# EAGLE design patchlink (EAGLE 6.6.0)
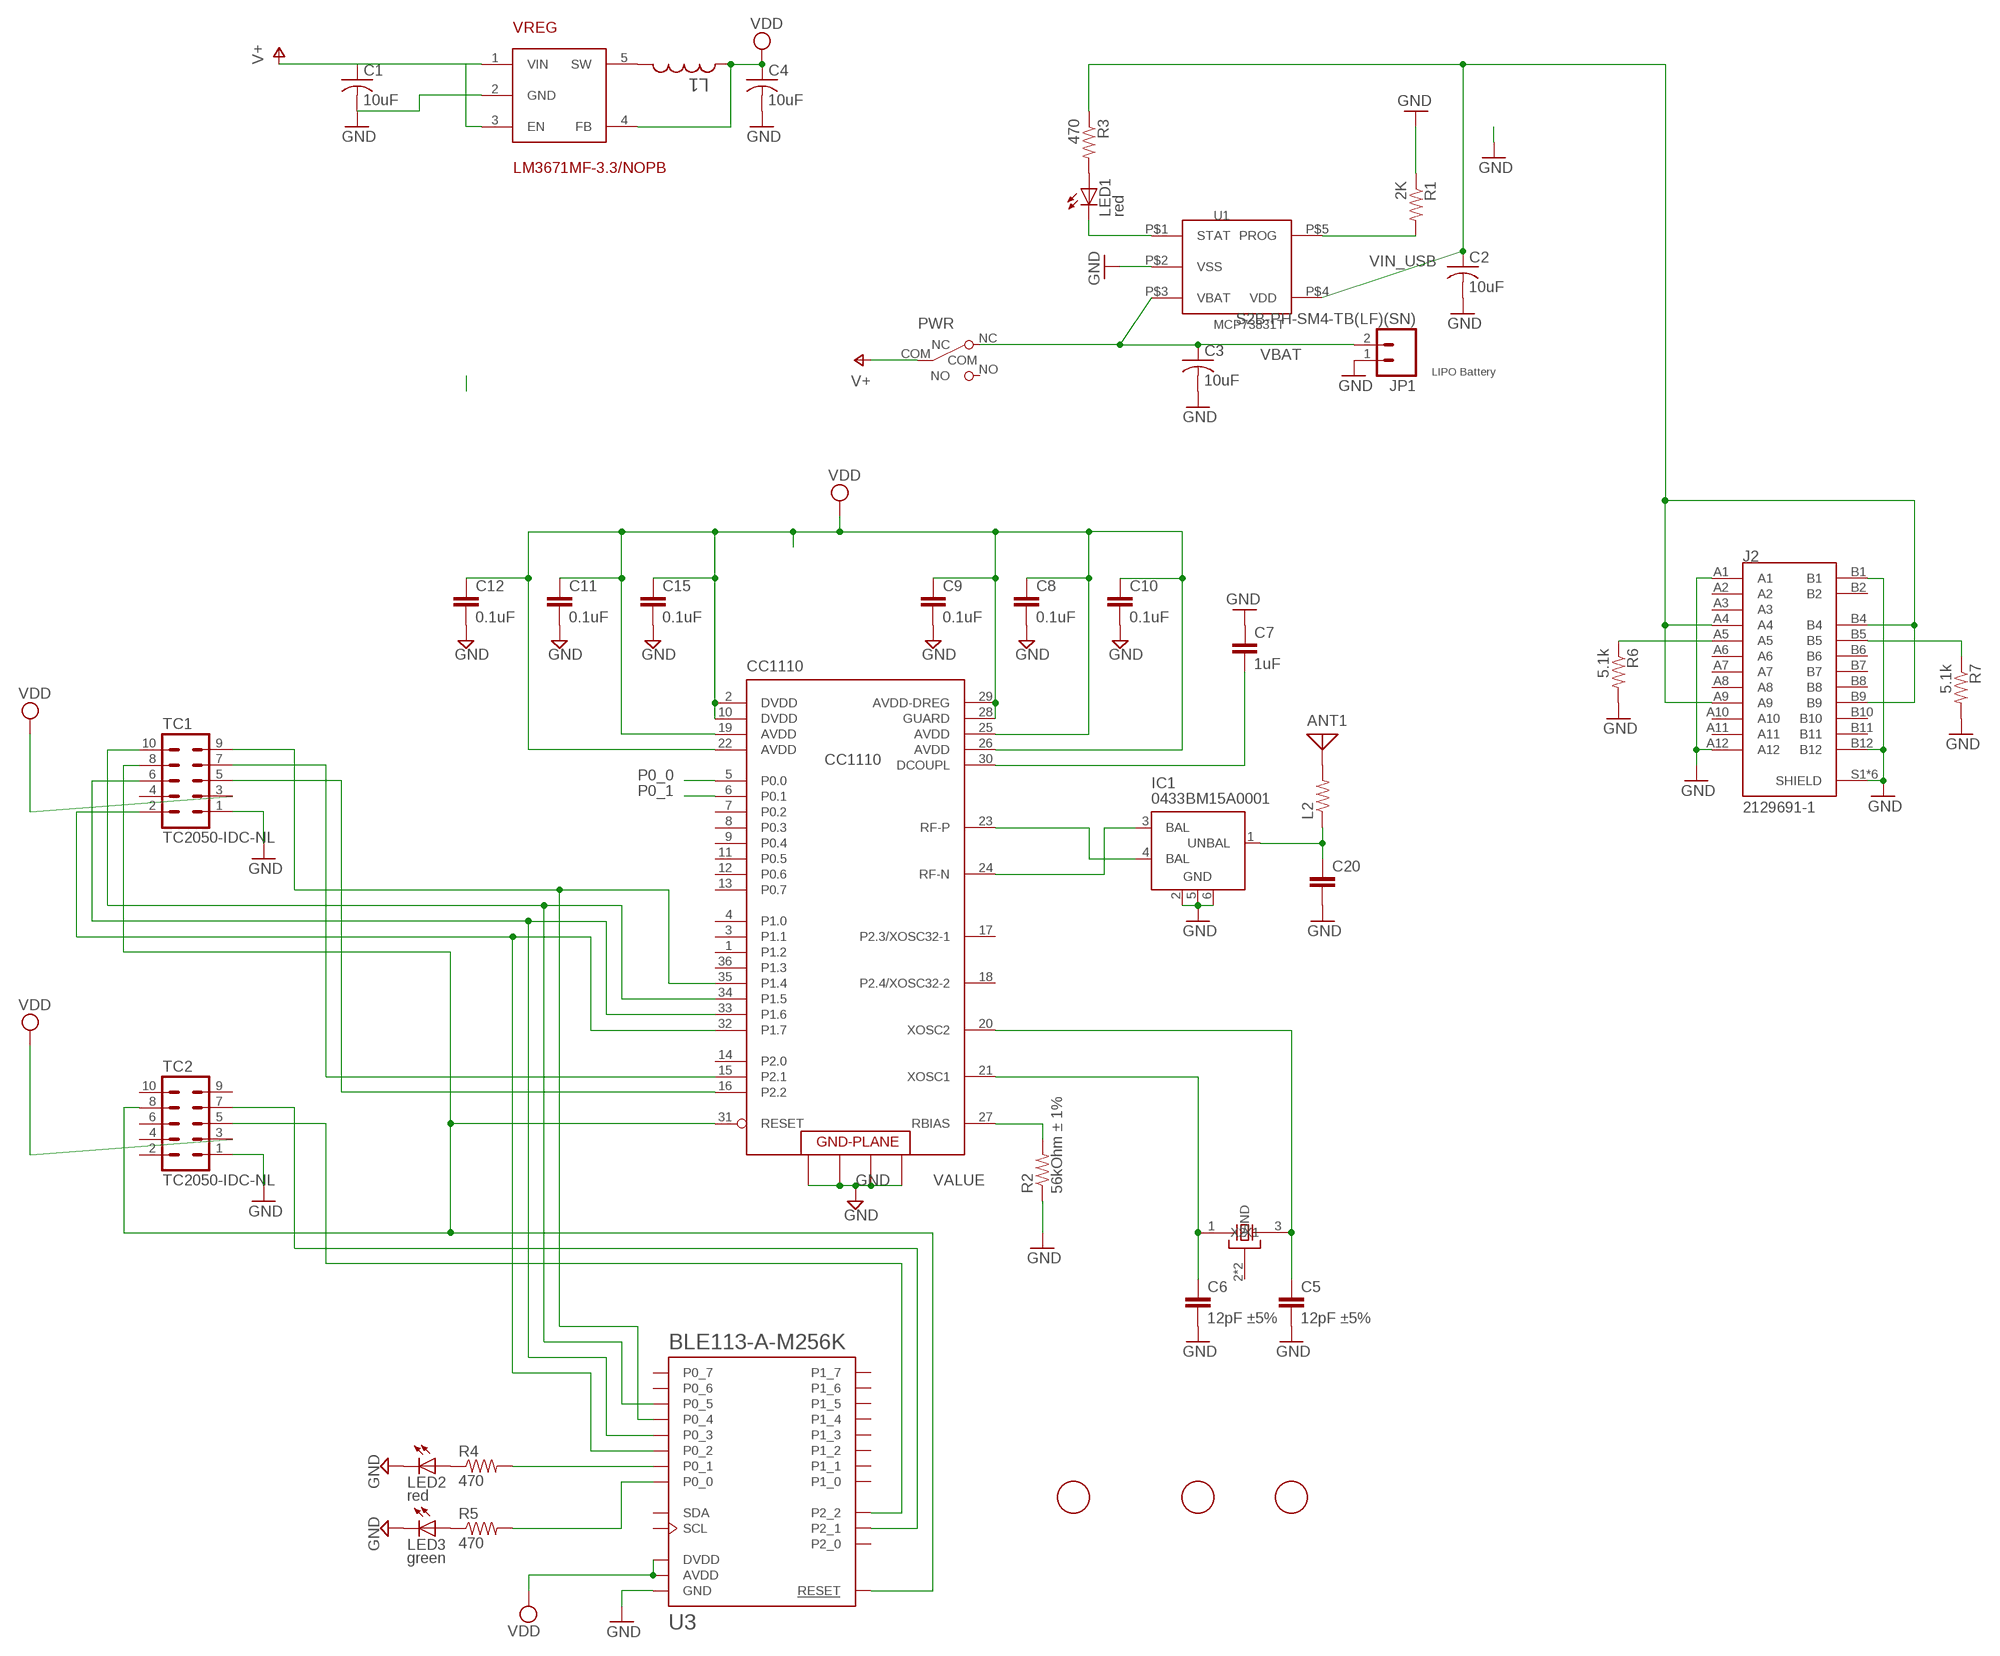
[diagram p0: schematic, sheet 1]

## Parts
ANT1  ANTENNASMT  [0433AT62A0020]
C1  10uF  C-USC1206  [C1206]
C2  10uF  C-USC1206  [C1206]
C3  10uF  C-USC1206  [C1206]
C4  10uF  C-USC1206  [C1206]
C5  12pF ±5%  C-EUC0402K  [C0402K]
C6  12pF ±5%  C-EUC0402K  [C0402K]
C7  1uF  C-EUC0402  [C0402]
C8  0.1uF  C-EUC0402  [C0402]
C9  0.1uF  C-EUC0402  [C0402]
C10  0.1uF  C-EUC0402  [C0402]
C11  0.1uF  C-EUC0402  [C0402]
C12  0.1uF  C-EUC0402  [C0402]
C15  0.1uF  C-EUC0402  [C0402]
C20  C-EUC0402  [C0402]
CC1110  CC1110F32RHHR  CC1110  [QLP-36_UPDATE]
FID1  FIDUCIAL  [FIDUCIAL_1MM]
FID2  FIDUCIAL  [FIDUCIAL_1MM]
FID3  FIDUCIAL  [FIDUCIAL_1MM]
IC1  0433BM15A0001  0915BM15A0001  [0915BM15A0001]
J2  2129691-1  [TE_2129691-1]
JP1  S2B-PH-SM4-TB(LF)(SN)  M02-JST-2MM-SMT  [JST-2-SMD]
L1  2.2 uH  L-USL2825P  [L2825P]
L2  R-US_R0402  [R0402]
LED1  red  LEDSML0603  [SML0603]
LED2  red  LEDSML0603  [SML0603]
LED3  green  LEDSML0603  [SML0603]
PWR  SW_SLIDE  [SLIDE_SWITCH_SMD]
R1  2K  R-US_R0402  [R0402]
R2  56kOhm ± 1%  R-US_R0402  [R0402]
R3  470  R-US_R0402  [R0402]
R4  470  R-US_R0402  [R0402]
R5  470  R-US_R0402  [R0402]
R6  5.1k  R-US_R0402  [R0402]
R7  5.1k  R-US_R0402  [R0402]
TC1  TC2050-IDC-NL  [TC2050-IDC-NL]
TC2  TC2050-IDC-NL  [TC2050-IDC-NL]
U1  MCP73831T  MCP73831  [5PIN_SOT23]
U3  BLE113-A-M256K  BLE113-A  [BLE113-A]
VREG  LM3671MF-3.3/NOPB  LM3671  [SOT23-5]
X1  24MHz 8pF 10ppm -20C +70C  CTS_32X25_SMD  [CTS_32X25]

## Nets
DC: CC1110.16(P2.2) TC1.5
DC_BLE: TC2.5 U3.P2_2
DD: CC1110.15(P2.1) TC1.7
DD_BLE: TC2.7 U3.P2_1
GND: C1.2 C2.2 C3.2 C4.2 C5.2 C6.2 C7.1 C8.2 C9.2 C10.2 C11.2 C12.2 C15.2 C20.2 CC1110.37(GND) CC1110.38(GND) CC1110.39(GND) CC1110.40(GND) IC1.2(GND) IC1.5(GND) IC1.6(GND) J2.A1 J2.A12 J2.B1 J2.B12 J2.S1(SHIELD) J2.S2(SHIELD) J2.S3(SHIELD) J2.S4(SHIELD) J2.S5(SHIELD) J2.S6(SHIELD) JP1.1 LED2.C LED3.C R1.1 R2.1 R6.2 R7.2 TC1.1 TC2.1 U1.P$2(VSS) U3.GND U3.GND@2(GND) U3.GND@3(GND) U3.GND@4(GND) U3.GND@5(GND) U3.GND@6(GND) U3.GND@7(GND) U3.GND@8(GND) U3.GND@9(GND) U3.GND@10(GND) VREG.2(GND)
MISO: CC1110.32(P1.7) TC1.2 U3.P0_2
MOSI: CC1110.33(P1.6) TC1.6 U3.P0_3
N$1: ANT1.P$1 L2.2
N$2: LED1.C U1.P$1(STAT)
N$3: R1.2 U1.P$5(PROG)
N$4: LED1.A R3.2
N$5: CC1110.24(RF-N) IC1.3(BAL)
N$7: CC1110.23(RF-P) IC1.4(BAL)
N$10: C20.1 IC1.1(UNBAL) L2.1
N$12: J2.A5 R6.1
N$13: J2.B5 R7.1
N$14: CC1110.27(RBIAS) R2.2
N$16: L1.2 VREG.5(SW)
N$18: C7.2 CC1110.30(DCOUPL)
N$20: C6.1 CC1110.21(XOSC1) X1.1(X1)
N$21: C5.1 CC1110.20(XOSC2) X1.3(X2)
N$29: LED2.A R4.1
N$30: LED3.A R5.1
N$31: R4.2 U3.P0_1
N$32: R5.2 U3.P0_0
P0_0: CC1110.5(P0.0)
P0_1: CC1110.6(P0.1)
RESET: CC1110.31(RESET) TC1.8 TC2.8 U3.RESET
SCK: CC1110.34(P1.5) TC1.10 U3.P0_5
SSN: CC1110.35(P1.4) TC1.9 U3.P0_4
V+: C1.1 PWR.COM VREG.1(VIN) VREG.3(EN)
VBAT: C3.1 JP1.2 PWR.NC U1.P$3(VBAT)
VDD: C4.1 C8.1 C9.1 C10.1 C11.1 C12.1 C15.1 CC1110.2(DVDD) CC1110.10(DVDD) CC1110.19(AVDD) CC1110.22(AVDD) CC1110.25(AVDD) CC1110.26(AVDD) CC1110.28(GUARD) CC1110.29(AVDD-DREG) L1.1 TC1.3 TC2.3 U3.AVDD U3.DVDD VREG.4(FB)
VIN_USB: C2.1 J2.A4 J2.A9 J2.B4 J2.B9 R3.1 U1.P$4(VDD)
Unconnected: CC1110.1(P1.2) CC1110.3(P1.1) CC1110.4(P1.0) CC1110.7(P0.2) CC1110.8(P0.3) CC1110.9(P0.4) CC1110.11(P0.5) CC1110.12(P0.6) CC1110.13(P0.7) CC1110.14(P2.0) CC1110.17(P2.3/XOSC32-1) CC1110.18(P2.4/XOSC32-2) CC1110.36(P1.3) J2.A2 J2.A3 J2.A6 J2.A7 J2.A8 J2.A10 J2.A11 J2.B2 J2.B6 J2.B7 J2.B8 J2.B10 J2.B11 PWR.NO TC1.4 TC2.2 TC2.4 TC2.6 TC2.9 TC2.10 U3.P0_6 U3.P0_7 U3.P1_0 U3.P1_1 U3.P1_2 U3.P1_3 U3.P1_4 U3.P1_5 U3.P1_6 U3.P1_7 U3.P2_0 U3.SCL U3.SDA

## Notes on the sheet
- LIPO Battery
- CC1110

## Power pins joined to a net without a drawn wire
GND: X1.2(GND) X1.4(GND)

## Library data of the parts
ANT1 = board:ANTENNA: Antenna
C1-C4 = rcl:C-US: CAPACITOR, American symbol
C5-C12 C15 C20 = rcl:C-EU: CAPACITOR
CC1110 = board:CC1110: True System-on-Chip with Low Power RF Transceiver and 8051 MCU
FID1-FID3 = adafruit:FIDUCIAL: For use by pick and place machines to calibrate the vision/machine, 1mm By microbuilder.eu
IC1 = parts:0915BM15A0001: 915 MHz Impedance Matched Balun-Filter For TI CC11xx Chipset family Data sheet <http://www.johansontechnology.com/datasheets/chipset-specific/0915BM15A0001.pdf>
J2 = 2129691-1:2129691-1: Conn USB 3.1 Type C RCP 24 POS Solder RA SMD 24 Terminal 1 Port T/R; AVAILABILITY: Unavailable; CENTERLINE_PITCH: .5 mm[.019 in]; COMMENT: 2129691-1; DESCRIPTION: USB3.1 TYPE-C REC MID-MOUNT 0.485 HYBRID; MF: TE Connectivity; MP: 2129691-1; NUMBER_OF_POSITIONS: 24; PACKAGE: None; PRICE: None; PRODUCT_TYPE: Connector; TE_PURCHASE_URL: https://www.te.com/usa-en/product-2129691-1.html?te_bu=Cor&te_type=disp&te_campaign=seda_glo_cor-seda-global-disp-prtnr-fy19-seda-model-bom-cta_sma-317_1&elqCampaignId=32493
JP1 = SparkFun-Connectors:M02: Standard 2-pin 0.1" header. Use with - straight break away headers ( PRT-00116) - right angle break away headers (PRT-00553) - swiss pins (PRT-00743) - machine pins (PRT-00117) - female headers (PRT-00115) Molex polarized connector foot print use with: PRT-08233 with associated crimp pins and housings. 2.54_SCREWTERM for use with PRT-10571. 3.5mm Screw Terminal footprints for PRT-08084 5mm Screw Terminal footprints for use with PRT-08432; PROD_ID: CONN-08352
L1 = rcl:L-US: INDUCTOR, American symbol
L2 R1-R7 = rcl:R-US_: RESISTOR
LED1-LED3 = led:LED: LED OSRAM: - CHIPLED LG R971, LG N971, LY N971, LG Q971, LY Q971, LO R971, LY R971 LH N974, LH R974 LS Q976, LO Q976, LY Q976 LO Q996 - Hyper CHIPLED LW Q18S LB Q993, LB Q99A, LB R99A - SideLED LS A670, LO A670, LY A670, LG A670, LP A670 LB A673, LV A673, LT A673, LW A673 LH A674 LY A675 LS A676, LA A676, LO A676, LY A676, LW A676 LS A679, LY A679, LG A679 - Hyper Micro SIDELED® LS Y876, LA Y876, LO Y876, LY Y876 LT Y87S - SmartLED LW L88C, LW L88S LB L89C, LB L89S, LG L890 LS L89K, LO L89K, LY L89K LS L896, LA L896, LO L896, LY L896 - TOPLED LS T670, LO T670, LY T670, LG T670, LP T670 LSG T670, LSP T670, LSY T670, LOP T670, LYG T670 LG T671, LOG T671, LSG T671 LB T673, LV T673, LT T673, LW T673 LH T674 LS T676, LA T676, LO T676, LY T676, LB T676, LH T676, LSB T676, LW T676 LB T67C, LV T67C, LT T67C, LS T67K, LO T67K, LY T67K, LW E67C LS E67B, LA E67B, LO E67B, LY E67B, LB E67C, LV E67C, LT E67C LW T67C LS T679, LY T679, LG T679 LS T770, LO T770, LY T770, LG T770, LP T770 LB T773, LV T773, LT T773, LW T773 LH T774 LS E675, LA E675, LY E675, LS T675 LS T776, LA T776, LO T776, LY T776, LB T776 LHGB T686 LT T68C, LB T68C - Hyper Mini TOPLED® LB M676 - Mini TOPLED Santana® LG M470 LS M47K, LO M47K, LY M47K Source: http://www.osram.convergy.de LUXEON: - LUMILED® LXK2-PW12-R00, LXK2-PW12-S00, LXK2-PW14-U00, LXK2-PW14-V00 LXK2-PM12-R00, LXK2-PM12-S00, LXK2-PM14-U00 LXK2-PE12-Q00, LXK2-PE12-R00, LXK2-PE12-S00, LXK2-PE14-T00, LXK2-PE14-U00 LXK2-PB12-K00, LXK2-PB12-L00, LXK2-PB12-M00, LXK2-PB14-N00, LXK2-PB14-P00, LXK2-PB14-Q00 LXK2-PR12-L00, LXK2-PR12-M00, LXK2-PR14-Q00, LXK2-PR14-R00 LXK2-PD12-Q00, LXK2-PD12-R00, LXK2-PD12-S00 LXK2-PH12-R00, LXK2-PH12-S00 LXK2-PL12-P00, LXK2-PL12-Q00, LXK2-PL12-R00 Source: www.luxeon.com KINGBRIGHT: KA-3528ASYC Source: www.kingbright.com
PWR = parts:SW_SLIDE
TC1 TC2 = TagConnect:TC2050-IDC: Tag-Connect In Circuit Programming & Debug Cable 10 Pin http://www.tag-connect.com
U1 = parts:MCP73831: Digikey No:- __MCP73831T-2ACI/OTCT-ND__
U3 = sf-bluegiga:BLE113: Bluetooth Low Energy single-mode module - Bluetooth 4.0 (CC2541). BLE113-A variant has an on-module ceramic chip antenna. BLE113-A variant includes keepout/restrict area. Antenna edge of the module should be flush up against the edge of the PCB. See datasheet for variant layout details. The BLE113 is a Bluetooth Smart module targeted for small and low-power sensors and accessories. It integrates all features required for a Bluetooth Smart application, including Bluetooth radio, software stack, and GATT-based profiles. The BLE113 Bluetooth Smart module can also host end-user applications, which means no external micro controller is required in size or price constrained devices. Moreover, it has flexible hardware interfaces to connect to different peripherals and sensors and can be powered directly from a standard 3V coin cell battery or a pair of AAA batteries. In the lowest power sleep mode it merely consumes 500 nA and will wake up within a few hundred microseconds. The BLE113 Bluetooth Smart module conusmer approximately 30% less power and is smaller than the BLE112 Bluetooth Smart Module. http://www.bluegiga.com/en-US/products/bluetooth-4.0-modules/ble113-bluetooth--smart-module https://github.com/jrowberg/sf-oshw Last updated 2014-01-04 by Jeff Rowberg <jeff@rowberg.net>; ANTENNA: On-module ceramic chip antenna
VREG = texas-custom:LM3671: Texas Instruments LM3671, LM3671Q 2MHz, 600mA Step-Down DC-DC Converter
X1 = cts_crystal:CTS_32X25_SMD

## Board
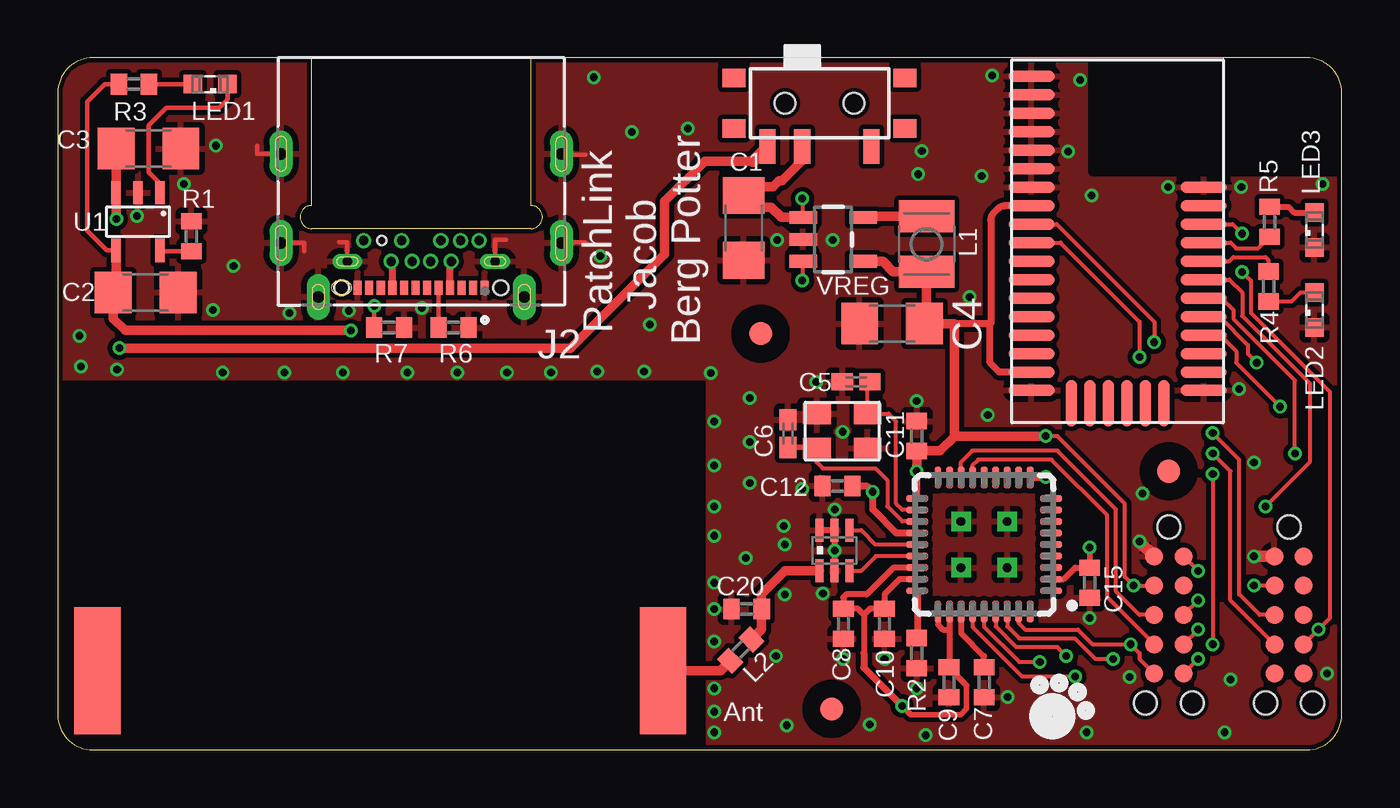
[diagram p1: board, top side]
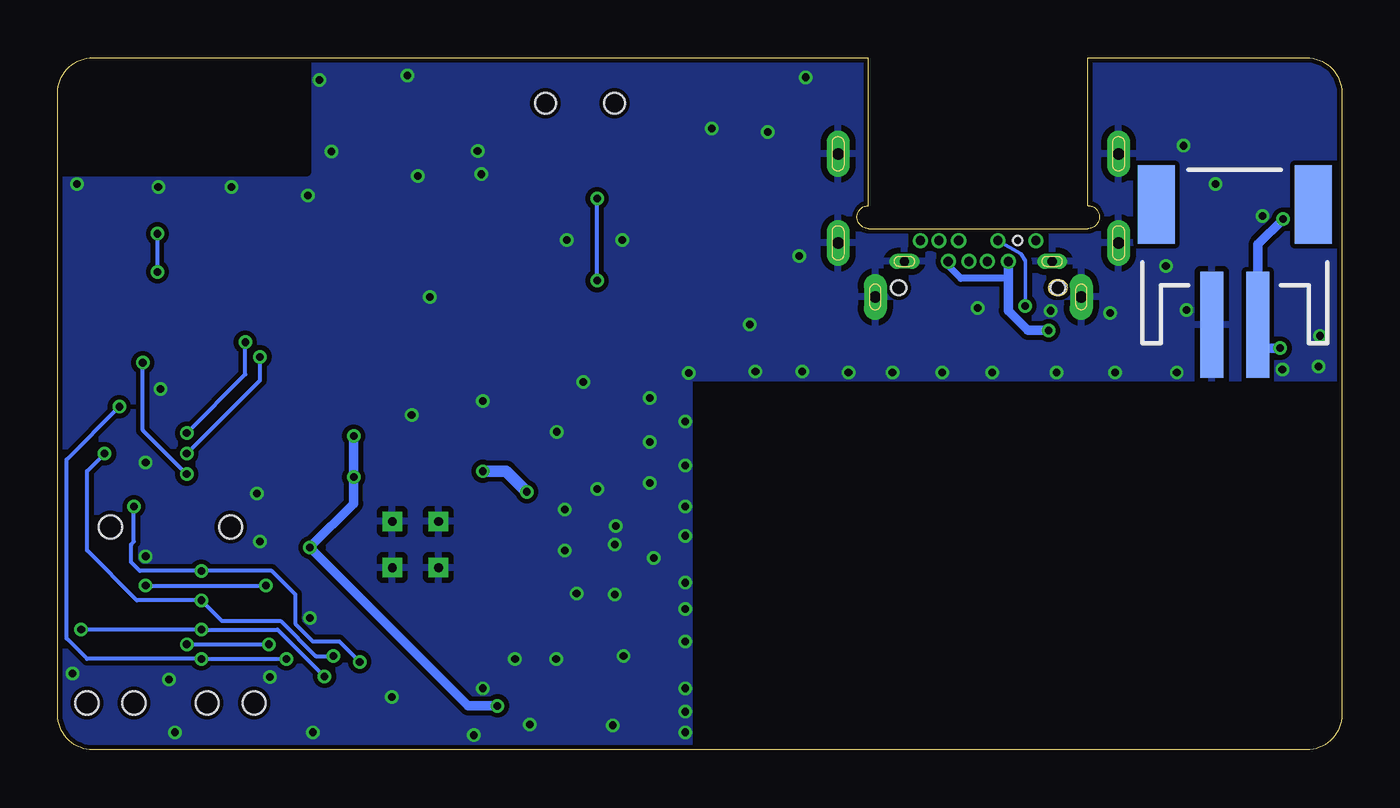
[diagram p2: board, bottom side, seen from below]

Size 55.63 x 29.97 mm. Coordinates in mm from the lower left corner, seen from the top.
Outline: 23.75,29.97 54.1,29.97 arc-90 55.63,28.45 55.63,1.52 arc-90 54.1,0 1.52,0 arc-90 0,1.52 0,28.45 arc-90 1.52,29.97 7.75,29.97
Copper layers (1*16): Top 0.0356mm / dielectric 1.5011mm / Bottom 0.0356mm
Design rules "oshpark *": minimum track width 6mil, minimum drill 13mil, track to track 6mil, track to pad 6mil, pad to pad 5mil, via to via 6mil, smd to smd 5mil, copper to edge 5mil, drill to drill 6mil, minimum pad ring 5mil, minimum via ring 5mil, stop-mask expansion 3mil, vias tented up to drill 21mil, thermal gap 10mil
bRestrict: area 0,0 to 10,10

### Footprints (pad centres in the part's own frame; a part is rotated, then mirrored left to right if it is on the bottom)
0433AT62A0020 = smd 2 x 5.5: P$1 -12.25,0; P$2 12.25,0
C1206 = smd 1.6 x 1.8: 1 -1.4,0; 2 1.4,0
C0402K = smd 0.925 x 0.74: 1 -0.6,0; 2 0.6,0
C0402 = smd 0.7 x 0.9: 1 -0.65,0; 2 0.65,0
QLP-36_UPDATE = smd 0.95 x 0.3: 1 -2.9,2; 2 -2.9,1.5; 3 -2.9,1; 4 -2.9,0.5; 5 -2.9,0; 6 -2.9,-0.5; 7 -2.9,-1; 8 -2.9,-1.5; 9 -2.9,-2; 19 2.9,-2; 20 2.9,-1.5; 21 2.9,-1; 22 2.9,-0.5; 23 2.9,0; 24 2.9,0.5; 25 2.9,1; 26 2.9,1.5; 27 2.9,2 | smd 0.3 x 0.95: 10 -2,-2.9; 11 -1.5,-2.9; 12 -1,-2.9; 13 -0.5,-2.9; 14 0,-2.9; 15 0.5,-2.9; 16 1,-2.9; 17 1.5,-2.9; 18 2,-2.9; 28 2,2.9; 29 1.5,2.9; 30 1,2.9; 31 0.5,2.9; 32 0,2.9; 33 -0.5,2.9; 34 -1,2.9; 35 -1.5,2.9; 36 -2,2.9 | drill 0.381 pad 0.85 square: 37 -1,1; 38 1,1; 39 -1,-1; 40 1,-1
FIDUCIAL_1MM = smd 1 x 1: 1 0,0
0915BM15A0001 = smd 0.35 x 1: 1 -0.65,-0.875; 2 0,-0.875; 3 0.65,-0.875; 4 0.65,0.875; 5 0,0.875; 6 -0.65,0.875
TE_2129691-1 = smd 0.35 x 0.6: A1 -2.75,4.6; A2 -2.25,4.6; A3 -1.75,4.6; A4 -1.25,4.6; A5 -0.75,4.6; A6 -0.25,4.6; A7 0.25,4.6; A8 0.75,4.6; A9 1.25,4.6; A10 1.75,4.6; A11 2.25,4.6; A12 2.75,4.6 | drill 0.4 pad 0.65 long: B1 3.2,3.46; B12 -3.2,3.46 | drill 0.4 pad 0.65: B2 2.5,2.56; B4 1.3,3.46; B5 0.85,2.56; B6 0.4,3.46; B7 -0.4,3.46; B8 -0.85,2.56; B9 -1.3,3.46; B10 -1.7,2.56; B11 -2.5,2.56 | drill 0.5 pad 1 long: S1 -6.075,-1.2; S2 6.075,-1.2; S3 -6.075,2.66; S4 6.075,2.66; S5 -4.465,5; S6 4.465,5 | hole 0.65: -3.45,4.6; 3.45,4.6 | hole 0.4: 1.7,2.56
JST-2-SMD = smd 1 x 4.6: 1 -1,-3.7; 2 1,-3.7 | smd 1.6 x 3.4: NC1 -3.4,1.5; NC2 3.4,1.5
L2825P = smd 1.4 x 2.4: 1 -1.2,0; 2 1.2,0
R0402 = smd 0.7 x 0.9: 1 -0.65,0; 2 0.65,0
SML0603 = smd 0.8 x 0.8: A 0.75,0; C -0.75,0
SLIDE_SWITCH_SMD = smd 0.7 x 1.5: COM 0.75,1.875; NC 2.25,1.875; NO -2.25,1.875 | smd 1 x 0.8: P$1 -3.7,-1.1; P$2 -3.7,1.1; P$3 3.7,1.1; P$4 3.7,-1.1 | hole 0.9: -1.5,0; 1.5,0
TC2050-IDC-NL = smd 0.787 x 0.787: 1 -2.54,-0.635; 2 -2.54,0.635; 3 -1.27,-0.635; 4 -1.27,0.635; 5 0,-0.635; 6 0,0.635; 7 1.27,-0.635; 8 1.27,0.635; 9 2.54,-0.635; 10 2.54,0.635 | hole 0.991: -3.81,0; 3.81,1.016; 3.81,-1.016
5PIN_SOT23 = smd 0.4 x 1: P$1 0.4,-0.63; P$2 1.35,-0.63; P$3 2.3,-0.63; P$4 2.3,1.87; P$5 0.4,1.87
BLE113-A = smd 2 x 0.5: AVDD -3.725,1.538; DVDD -3.725,-5.662; GND -3.725,7.138; GND@2 -3.725,6.338; GND@3 -3.725,5.537; GND@4 -3.725,4.737; GND@5 -3.725,3.938; GND@6 -3.725,3.138; GND@7 -3.725,2.337; GND@8 -3.725,-6.463; GND@9 3.725,-6.463; GND@10 3.725,2.337; NC -3.725,-4.862; NC@2 3.725,1.538; P0_0 3.725,-0.062; P0_1 3.725,-0.863; P0_2 3.725,-1.663; P0_3 3.725,-2.462; P0_4 3.725,-3.263; P0_5 3.725,-4.062; P0_6 3.725,-4.862; P0_7 3.725,-5.662; P1_6 -3.725,-2.462; P1_7 -3.725,-1.663; P2_0 -3.725,-0.863; P2_1 -3.725,-0.062; P2_2 -3.725,0.738; RESET 3.725,0.738; SCL -3.725,-3.263; SDA -3.725,-4.062 | smd 0.5 x 2: P1_0 2,-7.013; P1_1 1.2,-7.013; P1_2 0.4,-7.013; P1_3 -0.4,-7.013; P1_4 -1.2,-7.013; P1_5 -2,-7.013
SOT23-5 = smd 0.55 x 1.2: 1 -0.95,-1.3; 2 0,-1.3; 3 0.95,-1.3; 4 0.95,1.3; 5 -0.95,1.3
CTS_32X25 = smd 1.2 x 0.9: 1 -1.1,-0.7; 2 1.1,-0.7; 3 1.1,0.8; 4 -1.1,0.8

### Placement (x,y rotation side)
ANT1  13.97,3.43 180 top
C1  29.72,22.61 270 top
C2  3.81,19.81 0 top
C3  3.94,26.04 0 top
C4  36.14,18.45 180 top
C5  34.59,15.95 180 top
C6  31.64,13.7 90 top
C7  40.13,2.92 90 top
C8  34.04,5.46 270 top
C9  38.61,2.92 270 top
C10  35.81,5.46 270 top
C11  37.21,13.59 90 top
C12  33.78,11.43 180 top
C15  44.7,7.24 270 top
C20  29.84,6.1 180 top
CC1110  40.13,8.89 180 top
FID1  33.53,1.78 0 top
FID2  30.45,18.02 0 top
FID3  48.13,12.06 0 top
IC1  33.66,8.64 0 top
J2  15.75,24.61 180 top
JP1  4.64,22.11 0 bottom
L1  37.64,21.91 90 top
L2  29.59,4.32 225 top
LED1  6.6,28.83 180 top
LED2  54.44,19.05 90 top
LED3  54.44,22.51 90 top
PWR  33,28 180 top
R1  5.79,22.24 270 top
R2  37.21,4.19 90 top
R3  3.3,28.83 0 top
R4  52.45,20.07 90 top
R5  52.5,22.86 270 top
R6  17.14,18.29 0 top
R7  14.35,18.29 0 top
TC1  48.13,5.84 270 top
TC2  53.34,5.84 270 top
U1  4.83,23.5 180 top
U3  45.91,22.02 0 top
VREG  33.59,22.11 270 top
X1  33.99,13.76 0 top

### Tracks (layer width: path | path; a pad name or v marks a point on that pad's centre or on a via)
DC
  Top 0.178: CC1110.16 39.13,12.46 39.62,12.95 43.31,12.95 45.85,10.41 45.85,6.86 46.86,5.84 TC1.5
DC_BLE  (via drill 0.33)
  Top 0.178: v50.04,13.72 51.18,12.57 51.18,6.73 52.07,5.84 TC2.5 | U3.P2_2 43.28,22.76 47.5,18.54 v47.5,17.65
  Bottom 0.178: v50.04,13.72 47.5,16.26 v47.5,17.65
DD
  Top 0.178: CC1110.15 39.63,12.33 39.88,12.57 43.05,12.57 45.47,10.16 45.47,6.6 TC1.7
DD_BLE  (via drill 0.33)
  Top 0.178: TC2.7 50.8,6.48 50.8,12.06 v50.04,12.83 | U3.P2_1 43.44,21.96 46.86,18.54 v46.86,17.02
  Bottom 0.178: v50.04,12.83 46.86,16 v46.86,17.02
GND  (via drill 0.33, 0.33 pad 0.41)
  Top 0.203: J2.S1 21.82,25.78 22.86,25.78 | J2.S3 21.82,21.97 22.86,21.97 | J2.B12 18.95,22.1 19.43,22.1 | J2.B1 12.55,21.97 12.19,21.97 | J2.S4 10.67,21.95 10.67,21.59 | J2.S2 8.64,25.81 8.64,26.16
  Top 0.26: IC1.2 IC1.5 IC1.6
  Top 0.508: v51.82,8.38 TC2.1 | TC1.1 v46.86,9.02
  other vias: 31.45,9.7 27.3,26.9 39.5,19.6 54.79,24.5 23.5,21.38 24.87,26.75 28.29,16.32 33.15,6.76 35.18,1.1 25.4,16.38 44.29,29 44.79,24 44.7,5.71 35.81,3.94 46.43,3.16 46.99,11.11 40.29,14.5 37.28,24.93 1,16.59 0.95,17.93 37.44,25.93 23.23,29.12 34.04,3.94 23.37,16.38 40.02,24.85 2.58,16.47 17.31,16.35 31.17,22.08 33.57,22.08 3.43,23.11 29.8,8.3 28.45,0.76 31.58,1.06 37.21,2.67 51.82,12.45 41.15,2.29 34,13.78 32.86,15.93 37.21,15.11 33.66,10.41 33.66,8.64 32.26,11.3 51.18,15.62 28.45,1.65 28.45,2.67 28.45,6.1 28.45,7.24 28.45,9.27 28.45,10.54 28.45,12.32 28.45,14.22 21.37,16.35 19.46,16.35 15.15,16.35 12.35,16.35 9.81,16.35 7.15,16.35 31.5,8.89 31.5,6.73 28.45,4.7 5.46,24.51 6.86,26.16 7.62,20.95 6.73,19.05 10.03,18.92 12.61,19.02 15.78,19.14 25.65,18.41 29.97,15.24 29.97,13.34 29.97,11.56 31.11,4.06 37.59,0.64 44.58,0.76 50.55,0.76 54.99,3.3 50.8,3.05 51.27,24.38 48.1,24.38 43.78,25.91 40.48,29.21
  pour Bottom (isolate 0.203): 0,30 55.79,30 55.79,0 28.27,0 28.27,16.12 0,16.12
  pour Top (isolate 0.203, rank 2): 28.19,0 28.19,16.12 0,16.12 0,30 55.79,30 55.79,0
  pour Top (no thermals): 31.69,21.86 31.44,21.5 31.29,21.5 31.34,22.7 31.69,22.41
  pour Top (no thermals): 32.89,21.86 33.04,21.55 33.29,21.8 33.24,22.55 33.04,22.66 32.89,22.36
MISO  (via drill 0.33)
  Top 0.178: CC1110.32 40.13,5.33 41.66,3.81 v42.55,3.81 | U3.P0_2 50.76,20.36 51.31,19.81 51.31,18.8 54.23,15.88 54.23,12.45 v52.32,10.54 | TC1.2 v49.4,7.75
  Bottom 0.178: v52.32,10.54 52.32,9.02 52.45,8.89 52.45,8.13 52.07,7.75 v49.4,7.75 46.35,7.75 45.34,6.73 45.34,5.46 44.58,4.7 43.43,4.7 v42.55,3.81
MOSI  (via drill 0.33)
  Top 0.178: CC1110.33 40.63,5.34 41.53,4.45 43.31,4.45 v43.69,4.06 | U3.P0_3 50.41,19.56 50.93,19.05 50.93,18.67 53.59,16 v53.59,12.83 | v49.4,6.48 TC1.6
  Bottom 0.178: v43.69,4.06 44.45,4.06 45.97,5.59 48.51,5.59 v49.4,6.48 52.2,6.48 54.36,8.64 54.36,12.06 v53.59,12.83
N$1
  Top 0.406: L2.2 28.7,3.43 ANT1.P$1
N$2
  Top 0.203: U1.P$1 4.43,24.53 3.94,25.02 3.94,27.05 4.7,27.81 6.99,27.81 7.35,28.18 LED1.C
N$3
  Top 0.203: U1.P$5 4.43,21.59 R1.2
N$4
  Top 0.203: R3.2 LED1.A
N$5
  Top 0.178: IC1.3 34.81,7.76 35.44,8.39 CC1110.24
N$7
  Top 0.178: IC1.4 34.81,9.51 35.43,8.89 CC1110.23
N$10
  Top 0.406: L2.1 30.5,5.22 C20.1 30.5,6.75 31.51,7.76 IC1.1
N$12
  Top 0.203: J2.A5 R6.1
N$13  (via drill 0.33)
  Top 0.203: v13.72,19.23 13.72,18.29 R7.1
  Bottom 0.152: J2.B5 13.89,21.49 13.72,21.18 v13.72,19.23
N$14
  Top 0.305: CC1110.27 37.23,4.84 R2.2
N$16
  Top 0.406: VREG.5 34.94,23.11 L1.2
N$18
  Top 0.254: C7.2 40.13,4.06 39.13,5.06 CC1110.30
N$20
  Top 0.178: X1.1 32.89,12.45 33.15,12.19 35.43,12.19 35.94,11.68 35.94,10.54 36.59,9.89 CC1110.21
  Top 0.24: C6.1 32.85,13.1 X1.1
N$21
  Top 0.178: C5.1 35.09,15.95 X1.3 35.99,14.56 36.32,14.22 36.32,10.67 36.6,10.39 CC1110.20
N$29
  Top 0.178: R4.1 53.45,19.42 53.84,19.8 LED2.A
N$30
  Top 0.254: R5.1 53.32,23.51 53.58,23.26 LED3.A
N$31
  Top 0.178: U3.P0_1 50.75,21.16 50.93,21.34 52.32,21.34 52.45,21.21 R4.2
N$32
  Top 0.178: U3.P0_0 50.81,21.96 51.05,21.72 52,21.72 R5.2
RESET  (via drill 0.33)
  Top 0.178: CC1110.31 39.63,5.33 41.78,3.17 v44.07,3.17 | U3.RESET 50.9,22.76 v51.31,22.35 | v51.31,20.7 51.69,20.32 51.69,18.92 55.12,15.49 55.12,5.71 v54.61,5.21 TC2.8 | TC1.8 v49.4,5.21
  Bottom 0.178: v51.31,22.35 v51.31,20.7 | v54.61,5.21 v49.4,5.21 46.1,5.21 v44.07,3.17
SCK  (via drill 0.33)
  Top 0.178: CC1110.34 41.13,5.35 41.66,4.83 44.07,4.83 44.96,3.94 v45.72,3.94 | U3.P0_5 50.36,17.96 51.05,17.27 51.05,16.76 v52.96,14.86 | TC1.10 v49.4,3.94
  Bottom 0.178: v45.72,3.94 v49.4,3.94 54.36,3.94 55.24,4.83 55.24,12.57 v52.96,14.86
SSN  (via drill 0.33)
  Top 0.178: CC1110.35 41.63,5.49 41.91,5.21 44.2,5.21 44.83,4.57 v46.48,4.57 46.86,4.19 46.86,3.94 TC1.9 | v50.04,11.94 v50.04,4.57 | 49.63,18.75 50.34,18.75 51.56,17.53 51.56,17.14 v51.94,16.76
  Top 0.24: 49.63,18.75 U3.P0_4
  Bottom 0.178: v50.04,4.57 v46.48,4.57 | v50.04,11.94 51.94,13.84 v51.94,16.76
V+  (via drill 0.33)
  Top 0.178: VREG.3 32.26,21.16 v32.26,20.32 | v32.26,23.88 32.26,23.05 VREG.1
  Top 0.406: 32.34,23.05 VREG.1 31.35,23.05 30.91,23.5 29.72,23.5 C1.1 29.72,24.38 30.99,24.38 31.24,24.64 31.37,24.64 32.25,25.52 PWR.COM
  Bottom 0.178: v32.26,20.32 v32.26,23.88
VBAT  (via drill 0.33)
  Top 0.406: v2.54,22.99 2.53,22.99 U1.P$3 2.53,26.04 C3.1 | 30.13,25.5 28.04,25.5 26.29,23.75 26.29,21.46 22.23,17.4 v2.67,17.4
  Top 0.5: 30.13,25.5 PWR.NC
  Bottom 0.406: v2.54,22.99 3.64,21.89 JP1.2 3.64,17.4 v2.67,17.4
VDD  (via drill 0.33)
  Top 0.178: TC2.3 v51.82,7.11 | TC1.3 v46.61,7.11 46.23,7.49 46.23,10.67 43.31,13.59 v42.8,13.59
  Top 0.24: C15.1 v44.7,8.76 | 39.37,2.79 39.37,1.78 39.12,1.52 36.96,1.52 v36.58,1.91
  Top 0.254: CC1110.26 36.47,7.39 35.81,6.73 C10.1 35.19,6.11 34.92,5.84 | CC1110.25 36.21,7.89 35.05,6.73 34.16,6.73 34.04,6.6 C8.1 34.66,6.11 34.92,5.84 | 34.92,5.84 34.92,4.19 | CC1110.29 38.63,5.21 | 38.63,5.21 38.63,3.53 | CC1110.28 38.13,5.43 38.35,5.21 38.63,5.21 | CC1110.2 43.59,7.39 44.08,7.89 C15.1 | 38.63,3.53 39.37,2.79 | C9.1 38.61,3.56 38.63,3.53
  Top 0.3: 34.92,4.19 34.92,3.56 v36.58,1.91 | U3.AVDD 41.07,23.56 arc45 40.71,23.41 40.57,23.27 arc45 40.42,22.91
  Top 0.305: CC1110.19 37.21,10.89 v37.21,12.06 | CC1110.22 36.33,9.39 35.31,10.41 v35.31,11.18 35.05,11.43 C12.1 | CC1110.10 42.13,11.81 v42.8,11.81 | 40.42,22.91 40.42,18.45 | 40.42,18.45 38.84,18.45 | U3.DVDD 40.79,16.36 40.39,16.76 40.39,18.42 40.42,18.45
  Top 0.406: L1.1 37.79,20.86 | C4.1 37.64,18.45 | 37.64,18.45 L1.1 | L1.1 36.19,20.7 35.74,21.16 VREG.4 | C11.1 v37.21,12.06 37.21,12.95 38.23,12.95 38.86,13.59 | 38.86,13.59 38.84,13.59 38.84,18.45 37.64,18.45 | 38.86,13.59 v42.8,13.59
  Bottom 0.178: v51.82,7.11 v46.61,7.11
  Bottom 0.406: v42.8,13.59 v42.8,11.81 42.8,10.67 v44.7,8.76 37.85,1.91 v36.58,1.91
  Bottom 0.5: v35.31,11.18 36.2,12.06 v37.21,12.06
VIN_USB  (via drill 0.33)
  Top 0.203: U1.P$4 2.12,21.62 1.27,22.48 1.27,28.07 2.03,28.83 R3.1
  Top 0.305: J2.A9 14.5,21.15 J2.B4 | J2.A4 17,21.15 J2.B9
  Top 0.406: v12.7,18.16 2.92,18.16 2.41,18.67 C2.1 2.53,19.81 U1.P$4
  Bottom 0.305: J2.B9 17.05,20.96 16.51,20.42 14.45,20.42 J2.B4
  Bottom 0.406: J2.B4 14.45,19.02 13.59,18.16 v12.7,18.16

### Text on the board
tNames: PatchLink / Jacob / Berg Potter | Ant